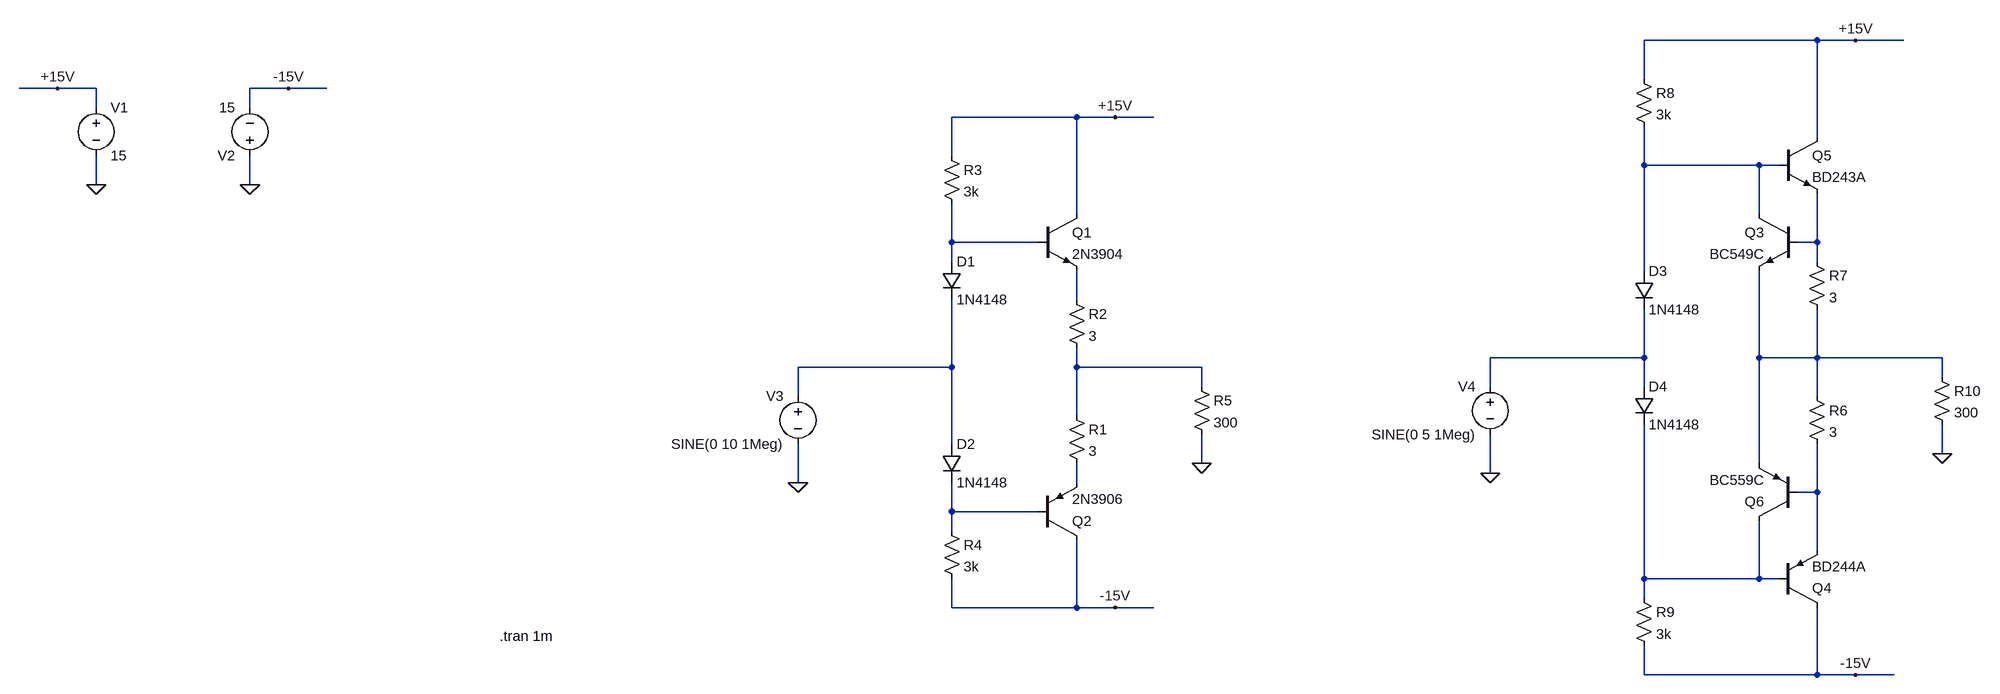
[diagram p0: schematic klasa_AB.asc]
klasa_AB.asc, the LTspice schematic file:
Version 4
SHEET 1 1928 924
WIRE 1584 -256 1296 -256
WIRE 1648 -256 1584 -256
WIRE 1728 -256 1648 -256
WIRE 1296 -192 1296 -256
WIRE -1344 -176 -1408 -176
WIRE -1280 -176 -1344 -176
WIRE -960 -176 -1024 -176
WIRE -896 -176 -960 -176
WIRE -1280 -144 -1280 -176
WIRE -1024 -144 -1024 -176
WIRE 352 -128 144 -128
WIRE 416 -128 352 -128
WIRE 480 -128 416 -128
WIRE 1584 -96 1584 -256
WIRE 144 -64 144 -128
WIRE 1296 -48 1296 -112
WIRE 1488 -48 1296 -48
WIRE 1520 -48 1488 -48
WIRE -1280 -16 -1280 -64
WIRE -1024 -16 -1024 -64
WIRE 352 32 352 -128
WIRE 1488 32 1488 -48
WIRE 144 80 144 16
WIRE 288 80 144 80
WIRE 1584 80 1584 0
WIRE 1584 80 1552 80
WIRE 144 112 144 80
WIRE 1584 112 1584 80
WIRE 1296 128 1296 -48
WIRE 352 176 352 128
WIRE 1296 272 1296 192
WIRE 1296 272 1040 272
WIRE 1488 272 1488 128
WIRE 1584 272 1584 192
WIRE 1584 272 1488 272
WIRE 1792 272 1584 272
WIRE 144 288 144 176
WIRE 144 288 -112 288
WIRE 352 288 352 256
WIRE 560 288 352 288
WIRE 1792 304 1792 272
WIRE 560 320 560 288
WIRE 1040 320 1040 272
WIRE 1296 320 1296 272
WIRE -112 336 -112 288
WIRE 1584 336 1584 272
WIRE 352 368 352 288
WIRE 144 416 144 288
WIRE 1792 432 1792 384
WIRE 560 448 560 400
WIRE 1488 448 1488 272
WIRE 1040 464 1040 400
WIRE -112 480 -112 416
WIRE 352 480 352 448
WIRE 1584 496 1584 416
WIRE 1584 496 1552 496
WIRE 144 528 144 480
WIRE 288 528 144 528
WIRE 144 560 144 528
WIRE 1584 592 1584 496
WIRE 1296 640 1296 384
WIRE 1488 640 1488 544
WIRE 1488 640 1296 640
WIRE 1520 640 1488 640
WIRE 1296 672 1296 640
WIRE 144 688 144 640
WIRE 352 688 352 576
WIRE 352 688 144 688
WIRE 416 688 352 688
WIRE 480 688 416 688
WIRE 1296 800 1296 752
WIRE 1584 800 1584 688
WIRE 1584 800 1296 800
WIRE 1648 800 1584 800
WIRE 1712 800 1648 800
FLAG 416 -128 +15V
FLAG 416 688 -15V
FLAG -1344 -176 +15V
FLAG -1280 -16 0
FLAG -1024 -16 0
FLAG -960 -176 -15V
FLAG 560 448 0
FLAG -112 480 0
FLAG 1648 -256 +15V
FLAG 1648 800 -15V
FLAG 1792 432 0
FLAG 1040 464 0
SYMBOL npn 288 32 R0
SYMATTR InstName Q1
SYMATTR Value 2N3904
SYMBOL pnp 288 576 M180
SYMATTR InstName Q2
SYMATTR Value 2N3906
SYMBOL res 336 352 R0
SYMATTR InstName R1
SYMATTR Value 3
SYMBOL res 336 160 R0
SYMATTR InstName R2
SYMATTR Value 3
SYMBOL diode 128 112 R0
SYMATTR InstName D1
SYMATTR Value 1N4148
SYMBOL diode 128 416 R0
SYMATTR InstName D2
SYMATTR Value 1N4148
SYMBOL voltage -1280 -160 R0
WINDOW 123 0 0 Left 0
WINDOW 39 0 0 Left 0
SYMATTR InstName V1
SYMATTR Value 15
SYMBOL voltage -1024 -48 R180
WINDOW 123 0 0 Left 0
WINDOW 39 0 0 Left 0
SYMATTR InstName V2
SYMATTR Value 15
SYMBOL res 128 -80 R0
SYMATTR InstName R3
SYMATTR Value 3k
SYMBOL res 128 544 R0
SYMATTR InstName R4
SYMATTR Value 3k
SYMBOL voltage -112 320 M0
WINDOW 123 0 0 Left 0
WINDOW 39 0 0 Left 0
SYMATTR InstName V3
SYMATTR Value SINE(0 10 1Meg)
SYMBOL res 544 304 R0
SYMATTR InstName R5
SYMATTR Value 300
SYMBOL pnp 1520 688 M180
SYMATTR InstName Q4
SYMATTR Value BD244A
SYMBOL res 1568 320 R0
SYMATTR InstName R6
SYMATTR Value 3
SYMBOL res 1568 96 R0
SYMATTR InstName R7
SYMATTR Value 3
SYMBOL diode 1280 128 R0
SYMATTR InstName D3
SYMATTR Value 1N4148
SYMBOL diode 1280 320 R0
SYMATTR InstName D4
SYMATTR Value 1N4148
SYMBOL res 1280 -208 R0
SYMATTR InstName R8
SYMATTR Value 3k
SYMBOL res 1280 656 R0
SYMATTR InstName R9
SYMATTR Value 3k
SYMBOL voltage 1040 304 M0
WINDOW 123 0 0 Left 0
WINDOW 39 0 0 Left 0
SYMATTR InstName V4
SYMATTR Value SINE(0 5 1Meg)
SYMBOL res 1776 288 R0
SYMATTR InstName R10
SYMATTR Value 300
SYMBOL npn 1520 -96 R0
SYMATTR InstName Q5
SYMATTR Value BD243A
SYMBOL npn 1552 32 M0
SYMATTR InstName Q3
SYMATTR Value BC549C
SYMBOL pnp 1552 544 R180
SYMATTR InstName Q6
SYMATTR Value BC559C
TEXT -608 736 Left 2 !.tran 1m

The netlist it stands for:
* klasa_AB.asc
Q1 +15V N002 N004 0 2N3904
Q2 -15V N011 N009 0 2N3906
R1 N008 N009 3
R2 N004 N008 3
D1 N002 N007 1N4148
D2 N007 N011 1N4148
V1 +15V 0 15
V2 0 -15V 15
R3 +15V N002 3k
R4 N011 -15V 3k
V3 N007 0 SINE(0 10 1Meg)
R5 N008 0 300
Q4 -15V N012 N010 0 BD244A
R6 N006 N010 3
R7 N003 N006 3
D3 N001 N005 1N4148
D4 N005 N012 1N4148
R8 +15V N001 3k
R9 N012 -15V 3k
V4 N005 0 SINE(0 5 1Meg)
R10 N006 0 300
Q5 +15V N001 N003 0 BD243A
Q3 N001 N003 N006 0 BC549C
Q6 N012 N010 N006 0 BC559C
.model D D
.lib standard.dio
.model NPN NPN
.model PNP PNP
.lib standard.bjt
.tran 1m
.backanno
.end